# EAGLE design RH029.1 (EAGLE 7.1.0)
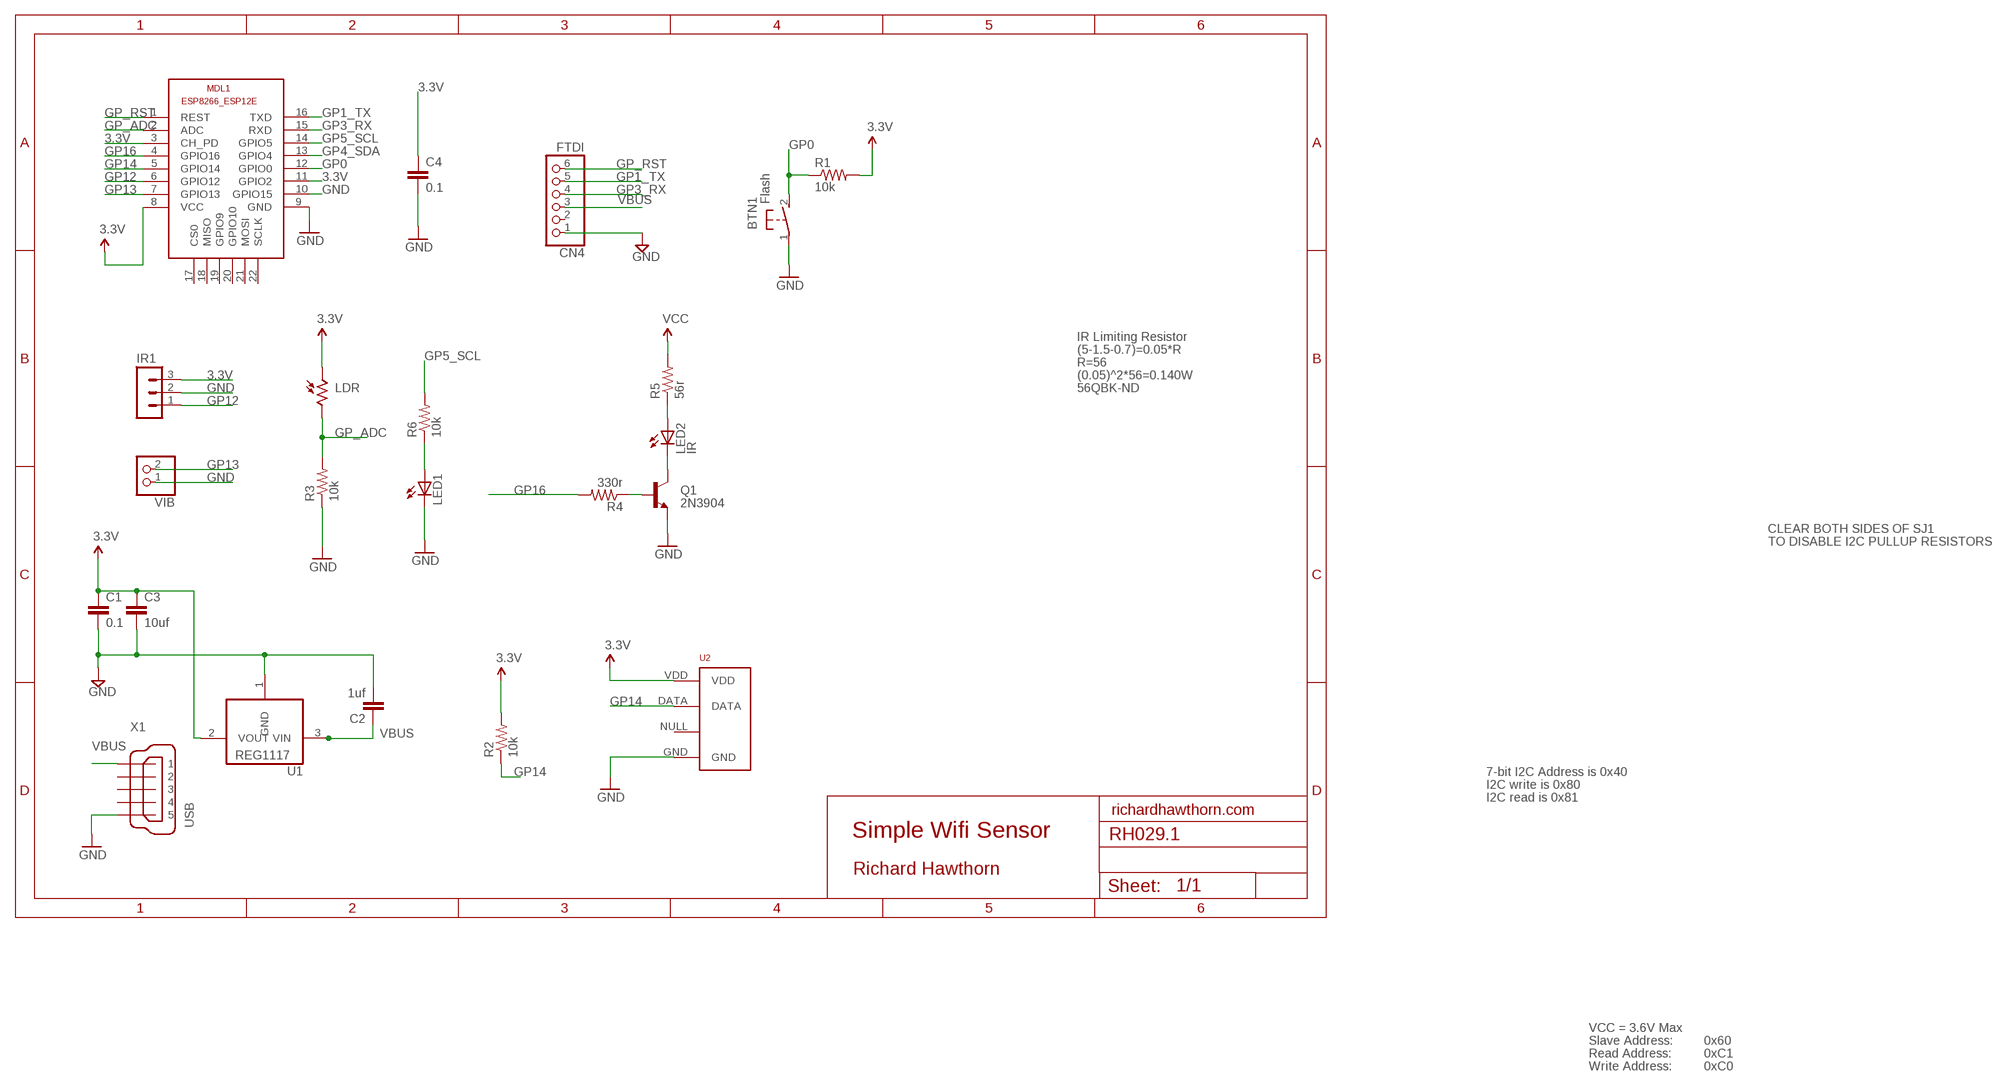
[diagram p0: schematic, sheet 1]

## Parts
BTN1  Flash  DTS-3  [DTS-3]
C1  0.1  CAPPTH2  [CAP-PTH-SMALL2]
C2  1uf  CAPPTH2  [CAP-PTH-SMALL2]
C3  10uf  CAPPTH2  [CAP-PTH-SMALL2]
C4  0.1  CAPPTH2  [CAP-PTH-SMALL2]
CN4  FTDI  PINHD-1X6  [1X06]
IR1  MA03-1  [MA03-1]
LDR  V1060_21  [TO-5_V10]
LED1  LED5MM  [LED5MM]
LED2  IR  LED5MM  [LED5MM]
MDL1  ESP8266-12EESP8266-ESP12E  [ESP8266-ESP12E]
Q1  2N3904  TRANSISTOR_NPNTO92  [TO-92]
R1  10k  R-US_0204/7  [0204/7]
R2  10k  R-US_0204/7  [0204/7]
R3  10k  R-US_0204/7  [0204/7]
R4  330r  R-US_0204/7  [0204/7]
R5  56r  R-US_0204/7  [0204/7]
R6  10k  R-US_0204/7  [0204/7]
U1  REG1117  [SOT223]
U2  RHT03_DHT-22_AM2302RA  [RHT03_DHT-22/RA]
VIB  PINHD-1X2  [1X02]
X1  USB  MINI-USB_SHIELD5P2-32005-601  [32005-601]

## Nets
3.3V: C1.1 C3.1 C4.1 IR1.3 LDR.1 MDL1.3(CH_PD) MDL1.8(VCC) MDL1.11(GPIO2) R1.2 R2.2 R5.2 U1.2(VOUT) U2.VDD ; supply symbol labelled VCC
GND [power]: BTN1.1 C1.2 C2.2 C3.2 C4.2 CN4.1 IR1.2 LED1.K(C) MDL1.9(GND) MDL1.10(GPIO15) Q1.1(E) R3.1 U1.1(GND) U2.GND VIB.1 X1.5
GP0: BTN1.2 MDL1.12(GPIO0) R1.1
GP1_TX: CN4.5 MDL1.16(TXD)
GP3_RX: CN4.4 MDL1.15(RXD)
GP4_SDA: MDL1.13(GPIO4)
GP5_SCL: MDL1.14(GPIO5) R6.2
GP12: IR1.1 MDL1.6(GPIO12)
GP13: MDL1.7(GPIO13) VIB.2
GP14: MDL1.5(GPIO14) R2.1 U2.DATA
GP16: MDL1.4(GPIO16) R4.2
GP_ADC: LDR.2 MDL1.2(ADC) R3.2
GP_RST: CN4.6 MDL1.1(REST)
N$1: LED1.A R6.1
N$2: Q1.2(B) R4.1
N$3: LED2.K(C) Q1.3(C)
N$5: LED2.A R5.1
VBUS [power]: C2.1 CN4.3 U1.3(VIN) X1.1
Unconnected: CN4.2 MDL1.17(CS0) MDL1.18(MISO) MDL1.19(GPIO9) MDL1.20(GPIO10) MDL1.21(MOSI) MDL1.22(SCLK) U2.NULL X1.2 X1.3 X1.4 X1.M1(S1) X1.M2(S2)

## Notes on the sheet
- IR Limiting Resistor
- (5-1.5-0.7)=0.05*R
- R=56
- (0.05)^2*56=0.140W
- 56QBK-ND
- CLEAR BOTH SIDES OF SJ1
- TO DISABLE I2C PULLUP RESISTORS
- 7-bit I2C Address is 0x40
- I2C write is 0x80
- I2C read is 0x81
- richardhawthorn.com
- Simple Wifi Sensor
- Richard Hawthorn
- VCC = 3.6V Max
- Slave Address: | 0x60
- Read Address: | 0xC1
- Write Address: | 0xC0

## Library data of the parts
BTN1 = switch-tact:DTS-3
C1-C4 = LowPowerLab:CAP: Capacitor Standard 0603 ceramic capacitor, and 0.1" leaded capacitor.
CN4 = pinhead:PINHD-1X6: PIN HEADER
IR1 = con-lstb:MA03-1: PIN HEADER; OC_FARNELL: unknown; OC_NEWARK: unknown
LDR = photo-elements:?1060*: Sensor Street Light control Source: http://optoelectronics.perkinelmer.com/content/Datasheets/DTS_PhotocellsB1060.pdf
LED1 = led:LED: LED OSRAM: - CHIPLED LG R971, LG N971, LY N971, LG Q971, LY Q971, LO R971, LY R971 LH N974, LH R974 LS Q976, LO Q976, LY Q976 LO Q996 - Hyper CHIPLED LW Q18S LB Q993, LB Q99A, LB R99A - SideLED LS A670, LO A670, LY A670, LG A670, LP A670 LB A673, LV A673, LT A673, LW A673 LH A674 LY A675 LS A676, LA A676, LO A676, LY A676, LW A676 LS A679, LY A679, LG A679 - Hyper Micro SIDELED® LS Y876, LA Y876, LO Y876, LY Y876 LT Y87S - SmartLED LW L88C, LW L88S LB L89C, LB L89S, LG L890 LS L89K, LO L89K, LY L89K LS L896, LA L896, LO L896, LY L896 - TOPLED LS T670, LO T670, LY T670, LG T670, LP T670 LSG T670, LSP T670, LSY T670, LOP T670, LYG T670 LG T671, LOG T671, LSG T671 LB T673, LV T673, LT T673, LW T673 LH T674 LS T676, LA T676, LO T676, LY T676, LB T676, LH T676, LSB T676, LW T676 LB T67C, LV T67C, LT T67C, LS T67K, LO T67K, LY T67K, LW E67C LS E67B, LA E67B, LO E67B, LY E67B, LB E67C, LV E67C, LT E67C LW T67C LS T679, LY T679, LG T679 LS T770, LO T770, LY T770, LG T770, LP T770 LB T773, LV T773, LT T773, LW T773 LH T774 LS E675, LA E675, LY E675, LS T675 LS T776, LA T776, LO T776, LY T776, LB T776 LHGB T686 LT T68C, LB T68C - Hyper Mini TOPLED® LB M676 - Mini TOPLED Santana® LG M470 LS M47K, LO M47K, LY M47K Source: http://www.osram.convergy.de LUXEON: - LUMILED® LXK2-PW12-R00, LXK2-PW12-S00, LXK2-PW14-U00, LXK2-PW14-V00 LXK2-PM12-R00, LXK2-PM12-S00, LXK2-PM14-U00 LXK2-PE12-Q00, LXK2-PE12-R00, LXK2-PE12-S00, LXK2-PE14-T00, LXK2-PE14-U00 LXK2-PB12-K00, LXK2-PB12-L00, LXK2-PB12-M00, LXK2-PB14-N00, LXK2-PB14-P00, LXK2-PB14-Q00 LXK2-PR12-L00, LXK2-PR12-M00, LXK2-PR14-Q00, LXK2-PR14-R00 LXK2-PD12-Q00, LXK2-PD12-R00, LXK2-PD12-S00 LXK2-PH12-R00, LXK2-PH12-S00 LXK2-PL12-P00, LXK2-PL12-Q00, LXK2-PL12-R00 Source: www.luxeon.com KINGBRIGHT: KA-3528ASYC Source: www.kingbright.com
LED2 = SparkFun:LED: LEDs Standard schematic elements and footprints for 5mm, 3mm, 1206, and 0603 sized LEDs. 5mm - Spark Fun Electronics SKU : COM-00529 (and others)
MDL1 = ESP8266-ESP12E:ESP8266-12E: ESP8266-12E with additional I/O and GPIO04/05 corrected The author cannot warrant that this library is free from error or will meet your specific requirements. Created by PuceBaboon.com. Komagane, Nagano, JAPAN
Q1 = SparkFun:TRANSISTOR_NPN: Transistor NPN BJT configuration in SOT23 package. MMBT2222 is the common NPN we use. Double check BCE configuration again layout.
R1-R6 = adafruit:R-US_: RESISTOR, American symbol
U1 = burr-brown:REG1117: 800mA and 1A Low Dropout (LDO) Positive Regulator 1.8V, 2.5V, 2.85V, 3.3V, 5V, and Adj; MPN: REG1117; OC_FARNELL: 1097566; OC_NEWARK: 14P6981
U2 = RHT03_DHT-22_AM2302:RHT03_DHT-22_AM2302: RHT03 / DHT-22 / AM2302 Packages and symbol for the RHT03 / DHT-22 relative humidity and temperature sensor. Note: The AM2302 is a wired version of the DHT-22 which typically requires less clearance and is thus provided as a separate package.; PROD_ID: SEN-10167
VIB = pinhead:PINHD-1X2: PIN HEADER
X1 = con-cypressindustries:MINI-USB_SHIELD5P2-: MINI USB-B R/A DIP 5pol. Source: www.cypressindustries.com; OC_FARNELL: unknown; OC_NEWARK: unknown

## Net classes
1 power: width 0.381 mm, clearance 0.254 mm

## Board
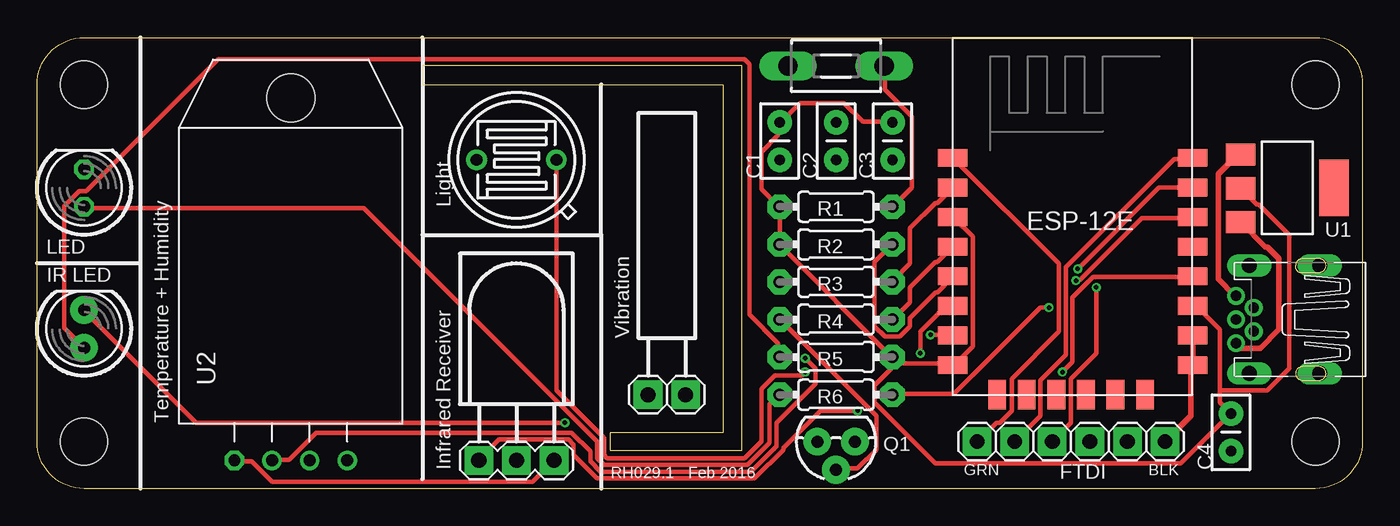
[diagram p1: board, top side]
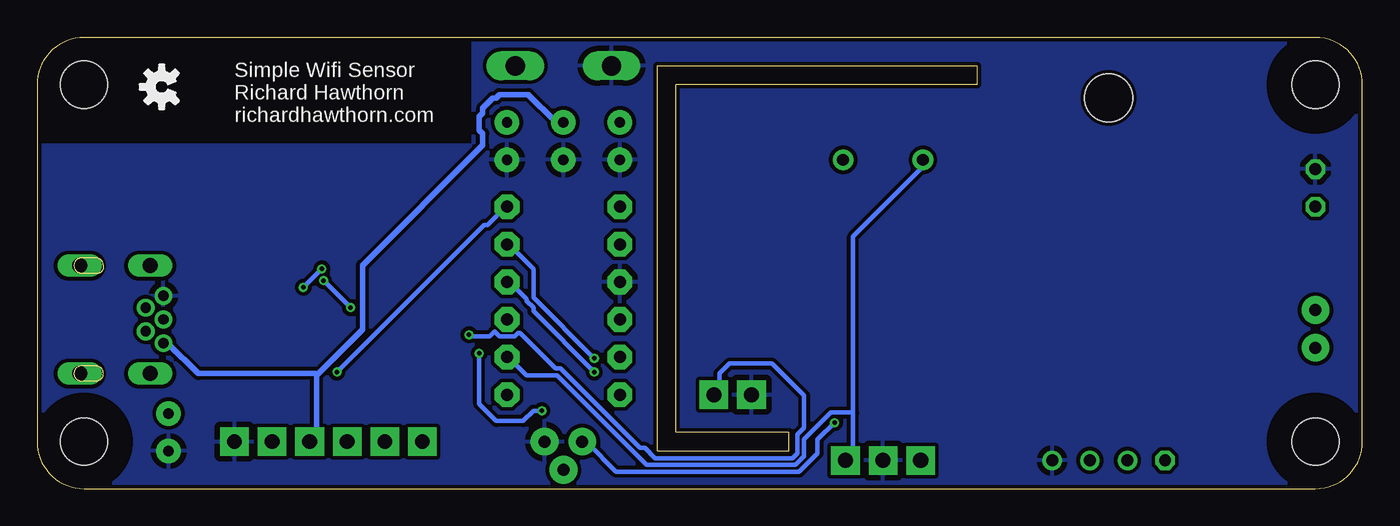
[diagram p2: board, bottom side, seen from below]

Size 89.53 x 30.48 mm. Coordinates in mm from the lower left corner, seen from the top.
Outline: 0,3.17 0,27.3 arc-90 3.17,30.48 86.36,30.48 arc-90 89.53,27.3 89.53,3.17 arc-90 86.36,0 3.17,0 arc-90 0,3.17
Outline: 47.62,2.54 47.62,28.57 26.04,28.57 26.04,27.3 46.35,27.3 46.35,3.81 38.73,3.81 38.73,2.54 47.62,2.54
Copper layers (1*16): Top 0.035mm / dielectric 1.5mm / Bottom 0.035mm
Design rules "ITEADstudio_DRC *": minimum track width 12mil, minimum drill 12mil, track to track 6mil, track to pad 6mil, pad to pad 6mil, via to via 6mil, smd to smd 0mil, copper to edge 10mil, drill to drill 10mil, minimum pad ring 10mil, minimum via ring 6mil, stop-mask expansion 2mil, vias tented up to drill 100mil, thermal gap 15mil
Holes 3.2 mm at 3.17,3.17 86.36,3.17 3.17,27.3 86.36,27.3
tRestrict: area 60.3,23.5 to 89.5,30.5
bRestrict: area 60.3,23.5 to 89.5,30.5; area 0,0 to 6.3,6.3; area 0,24.1 to 6.3,30.5; area 83.2,0 to 89.5,6.3

### Footprints (pad centres in the part's own frame; a part is rotated, then mirrored left to right if it is on the bottom)
DTS-3 = drill 1.3 long: 1 -3.25,0; 2 3.25,0
CAP-PTH-SMALL2 = drill 0.7 pad 1.651: 1 0,0; 2 2.54,0
1X06 = drill 1 pad 1.93 square: 1 -6.35,0; 2 -3.81,0; 3 -1.27,0; 4 1.27,0; 5 3.81,0; 6 6.35,0
MA03-1 = drill 1.016 pad 1.93 square: 1 -2.54,0; 2 0,0; 3 2.54,0
TO-5_V10 = drill 0.8 pad 1.4: 1 -2.7,0; 2 2.7,0
LED5MM = drill 0.813 octagon: A -1.27,0; K 1.27,0
LED5MM' = drill 0.813 pad 1.88: A -1.27,0; K 1.27,0
ESP8266-ESP12E = smd 2 x 1.2: 1 0,16; 2 0,14; 3 0,12; 4 0,10; 5 0,8; 6 0,6; 7 0,4; 8 0,2; 9 16.2,2; 10 16.2,4; 11 16.2,6; 12 16.2,8; 13 16.2,10; 14 16.2,12; 15 16.2,14; 16 16.2,16 | smd 1.2 x 2: 17 11,0; 18 3,0; 19 5,0; 20 13,0; 21 7,0; 22 9,0
TO-92 = drill 0.813 pad 1.88: 1 -1.27,0; 2 0,1.905; 3 1.27,0
0204/7 = drill 0.813 pad 1.676 octagon: 1 -3.81,0; 2 3.81,0
SOT223 = smd 1.499 x 2.007: 1 -2.261,-3.15; 2 0.025,-3.15; 3 2.311,-3.15 | smd 3.81 x 2.007: 4 0,3.15
RHT03_DHT-22/RA = drill 0.8: DATA -1.27,0; GND 3.81,0; NULL 1.27,0 | drill 0.8 octagon: VDD -3.81,0 | hole 3.25: 0,24.5
1X02 = drill 1.016 pad 1.93 square: 1 -1.27,0; 2 1.27,0
32005-601 = drill 0.7 pad 1.016: 1 2.825,1.6; 2 1.625,0.8; 3 2.825,0; 4 1.625,-0.8; 5 2.825,-1.6 | drill 1 pad 1.422 long: M1 -2.825,3.65; M2 -2.825,-3.65; M3 1.925,3.65; M4 1.925,-3.65

### Placement (x,y rotation side)
BTN1  53.98,28.57 0 top
C1  50.16,24.77 270 top
C2  53.98,24.77 270 top
C3  57.78,24.77 270 top
C4  80.64,5.08 270 top
CN4  69.85,3.17 180 top
IR1  32.38,1.91 0 top
LDR  32.38,22.23 0 top
LED1  3.17,20.32 90 top
LED2  IR  [LED5MM']  3.17,10.79 90 top
MDL1  61.85,6.35 0 top
Q1  53.98,3.17 180 top
R1  53.98,19.05 180 top
R2  53.98,16.51 180 top
R3  53.98,13.97 0 top
R4  53.98,11.43 0 top
R5  53.98,8.89 0 top
R6  53.98,6.35 0 top
U1  84.45,20.32 270 top
U2  17.14,1.91 0 top
U$3  [OSHW-LOGO-S]  81.11,27.15 90 bottom
VIB  42.55,6.35 0 top
X1  83.82,11.43 180 top

### Tracks (layer width: path | path; a pad name or v marks a point on that pad's centre or on a via)
3.3V
  Top 0.305: U2.VDD 13.37,1.83 14.52,1.83 15.89,0.46 33.49,0.46 34.86,1.83 IR1.3 | 79.9,6.63 79.9,5.83 C4.1 80.58,5.03 77.27,1.71 60.69,1.71 56.58,5.83 56.58,6.97 58.06,8.46 R5.2 | 79.9,6.63 79.9,10.74 78.3,12.34 78.07,12.34 MDL1.11 | 79.9,6.63 83.1,6.63 84.58,8.12 84.58,17.14 82.53,19.2 82.41,19.2 81.38,20.23 U1.2 | R5.2 57.84,8.8 58.18,8.46 61.84,8.46 MDL1.8 61.95,8.34 63.21,9.6 63.21,17.03 61.95,18.29 MDL1.3 | C3.1 57.72,24.8 55.78,24.8 54.52,26.06 51.55,26.06 50.29,24.8 C1.1 50.06,24.69 50.06,23.89 48.92,22.75 48.92,20.23 50.06,19.09 R1.2 50.18,18.97 50.18,16.57 R2.2 50.18,16.46 57.72,8.91 R5.2
  Bottom 0.305: 34.4,5.14 34.4,2.4 34.86,1.94 IR1.3 | 34.4,5.14 34.4,17.03 29.72,21.72 29.72,22.17 LDR.1 | 34.4,5.14 35.89,5.14 37.72,3.31 37.72,2.17 38.29,1.6 48.35,1.6 54.41,7.66 56.46,7.66 57.72,8.91 R5.2
GND
  Top 0.381: MDL1.10 78.07,10.29 78.07,8.46 MDL1.9 77.95,8.23 77.95,4.92 76.24,3.2 CN4.1 | U1.1 81.27,22.52 81.04,22.52 79.78,21.26 79.78,14.17 80.92,13.03 X1.5
  pour Bottom: 0,30.48 0,0 89.53,0 89.53,30.48
GP0  (via drill 0.3)
  Top 0.305: v69.27,7.89 69.95,8.57 69.95,12.92 71.32,14.29 77.95,14.29 MDL1.12 | BTN1.2 57.26,28.57 57.26,26.98 59.09,25.15 59.09,20.34 57.84,19.09 R1.1
  Bottom 0.305: v69.27,7.89 59.32,17.83 59.09,17.83 57.84,19.09 R1.1
GP1_TX
  Top 0.305: CN4.5 67.78,4.92 67.78,7.32 69.49,9.03 69.49,14.97 76.81,22.29 77.95,22.29 MDL1.16
GP3_RX  (via drill 0.3)
  Top 0.305: v70.29,14.86 75.78,20.34 77.95,20.34 MDL1.15 | v71.55,13.6 71.55,9.14 69.84,7.43 69.84,4.46 68.58,3.2 CN4.4
  Bottom 0.305: v71.55,13.6 v70.29,14.86
GP5_SCL  (via drill 0.3)
  Top 0.305: v70.18,14.06 70.41,14.06 74.64,18.29 77.95,18.29 MDL1.14 | v68.35,12.23 67.78,12.23 61.95,6.4 57.84,6.4 R6.2
  Bottom 0.305: v68.35,12.23 v70.18,14.06
GP12  (via drill 0.3)
  Top 0.305: v59.66,9.14 59.66,10.63 61.38,12.34 61.84,12.34 MDL1.6 | v55.44,5.26 52.92,5.26 50.41,2.74 50.41,2.63 48.46,0.69 37.83,0.69 36.23,2.29 36.23,2.97 35.89,3.31 31.2,3.31 29.83,1.94 IR1.1
  Bottom 0.305: v59.66,9.14 59.66,5.71 58.52,4.57 56.69,4.57 56.01,5.26 v55.44,5.26
GP13  (via drill 0.3)
  Top 0.305: v60.35,10.4 61.84,10.4 MDL1.7
  Bottom 0.305: v60.35,10.4 60.24,10.29 58.98,10.29 58.64,10.63 58.29,10.29 57.26,10.29 57.04,10.52 56.92,10.52 54.52,8.12 54.18,8.12 48.81,2.74 48.46,2.74 47.78,2.06 38.52,2.06 38.18,2.4 38.18,3.66 37.72,4.12 37.72,6.29 39.89,8.46 42.75,8.46 43.43,7.77 43.43,6.74 43.78,6.4 VIB.2
GP14  (via drill 0.3)
  Top 0.305: MDL1.5 61.84,14.29 60.81,13.26 60.69,13.26 58.98,11.54 58.98,10.97 58.29,10.29 57.26,10.29 56.58,10.97 56.58,15.32 57.72,16.46 R2.1 | v51.89,8.8 52.58,8.12 52.58,7.09 49.95,4.46 49.95,2.86 48.23,1.14 38.06,1.14 37.38,1.83 37.38,2.52 36.12,3.77 18.86,3.77 17.03,1.94 15.89,1.94 U2.DATA
  Bottom 0.305: v51.89,8.8 56.01,12.92 56.01,14.86 57.72,16.57 R2.1
GP16
  Top 0.305: MDL1.4 61.84,16.34 60.81,15.32 60.69,15.32 58.98,13.6 58.98,12.57 57.84,11.43 R4.2
GP_ADC  (via drill 0.3)
  Top 0.305: MDL1.2 61.84,20.34 60.81,19.32 60.69,19.32 58.98,17.6 58.98,15.2 57.84,14.06 R3.2 | v51.89,7.89 51.66,7.66 49.84,7.66 48.92,6.74 48.92,3.2 47.78,2.06 38.52,2.06 38.29,2.29 38.29,3.43 35.09,6.63 35.09,22.17 LDR.2
  Bottom 0.305: v51.89,7.89 56.01,12 56.01,12.23 56.46,12.69 56.46,12.8 57.72,14.06 R3.2
GP_RST
  Top 0.305: MDL1.1 61.95,22.29 69.04,15.2 69.04,10.63 65.84,7.43 65.84,5.26 65.04,4.46 64.81,4.46 63.55,3.2 CN4.6
N$1
  Top 0.305: LED1.A 3.2,18.97 22.06,18.97 37.83,3.2 37.83,2.06 38.29,1.6 48.01,1.6 49.49,3.09 49.49,5.71 50.06,6.29 R6.1
N$2
  Top 0.305: R4.1 50.18,11.43 56.69,4.92 56.69,2.63 55.44,1.37 54.06,1.37 Q1.2
N$3  (via drill 0.3)
  Top 0.305: v35.66,4.46 10.74,4.46 3.2,12 LED2.K
  Bottom 0.305: v35.66,4.46 36.8,3.31 36.8,2.4 38.06,1.14 50.41,1.14 52.35,3.09 52.69,3.09 Q1.3
N$5
  Top 0.305: R5.1 50.06,8.91 50.06,9.83 48.12,11.77 48.12,28.69 47.78,29.03 12.23,29.03 3.31,20.12 2.86,20.12 1.83,19.09 1.83,10.86 3.09,9.6 LED2.A
VBUS
  Top 0.381: U1.3 81.38,17.95 82.98,16.34 83.1,16.34 83.9,15.54 83.9,10.74 82.64,9.49 81.38,9.49 81.04,9.83 X1.1
  Bottom 0.381: 70.64,7.66 67.55,10.74 67.55,15.09 59.44,23.2 59.44,24 59.66,24.23 59.66,25.15 59.44,25.38 59.44,25.72 58.75,26.4 58.52,26.4 58.29,26.63 56.35,26.63 54.52,24.8 54.06,24.8 C2.1 | 70.64,7.66 70.64,3.66 CN4.3 | X1.1 80.92,9.83 80.7,9.83 78.64,7.77 70.75,7.77 70.64,7.66

### Text on the board
tPlace: Light | LED | IR LED | Vibration | Temperature + Humidity | Infrared Receiver
tNames: RH029.1 Feb 2016 | GRN | FTDI | BLK
bNames: Simple Wifi Sensor / Richard Hawthorn / richardhawthorn.com
tDocu: REG